# EAGLE design Kopfhörerverstärker DAC Board CP2114 Rev 1.1 (EAGLE 6.4)

## Sheet 1 of 3
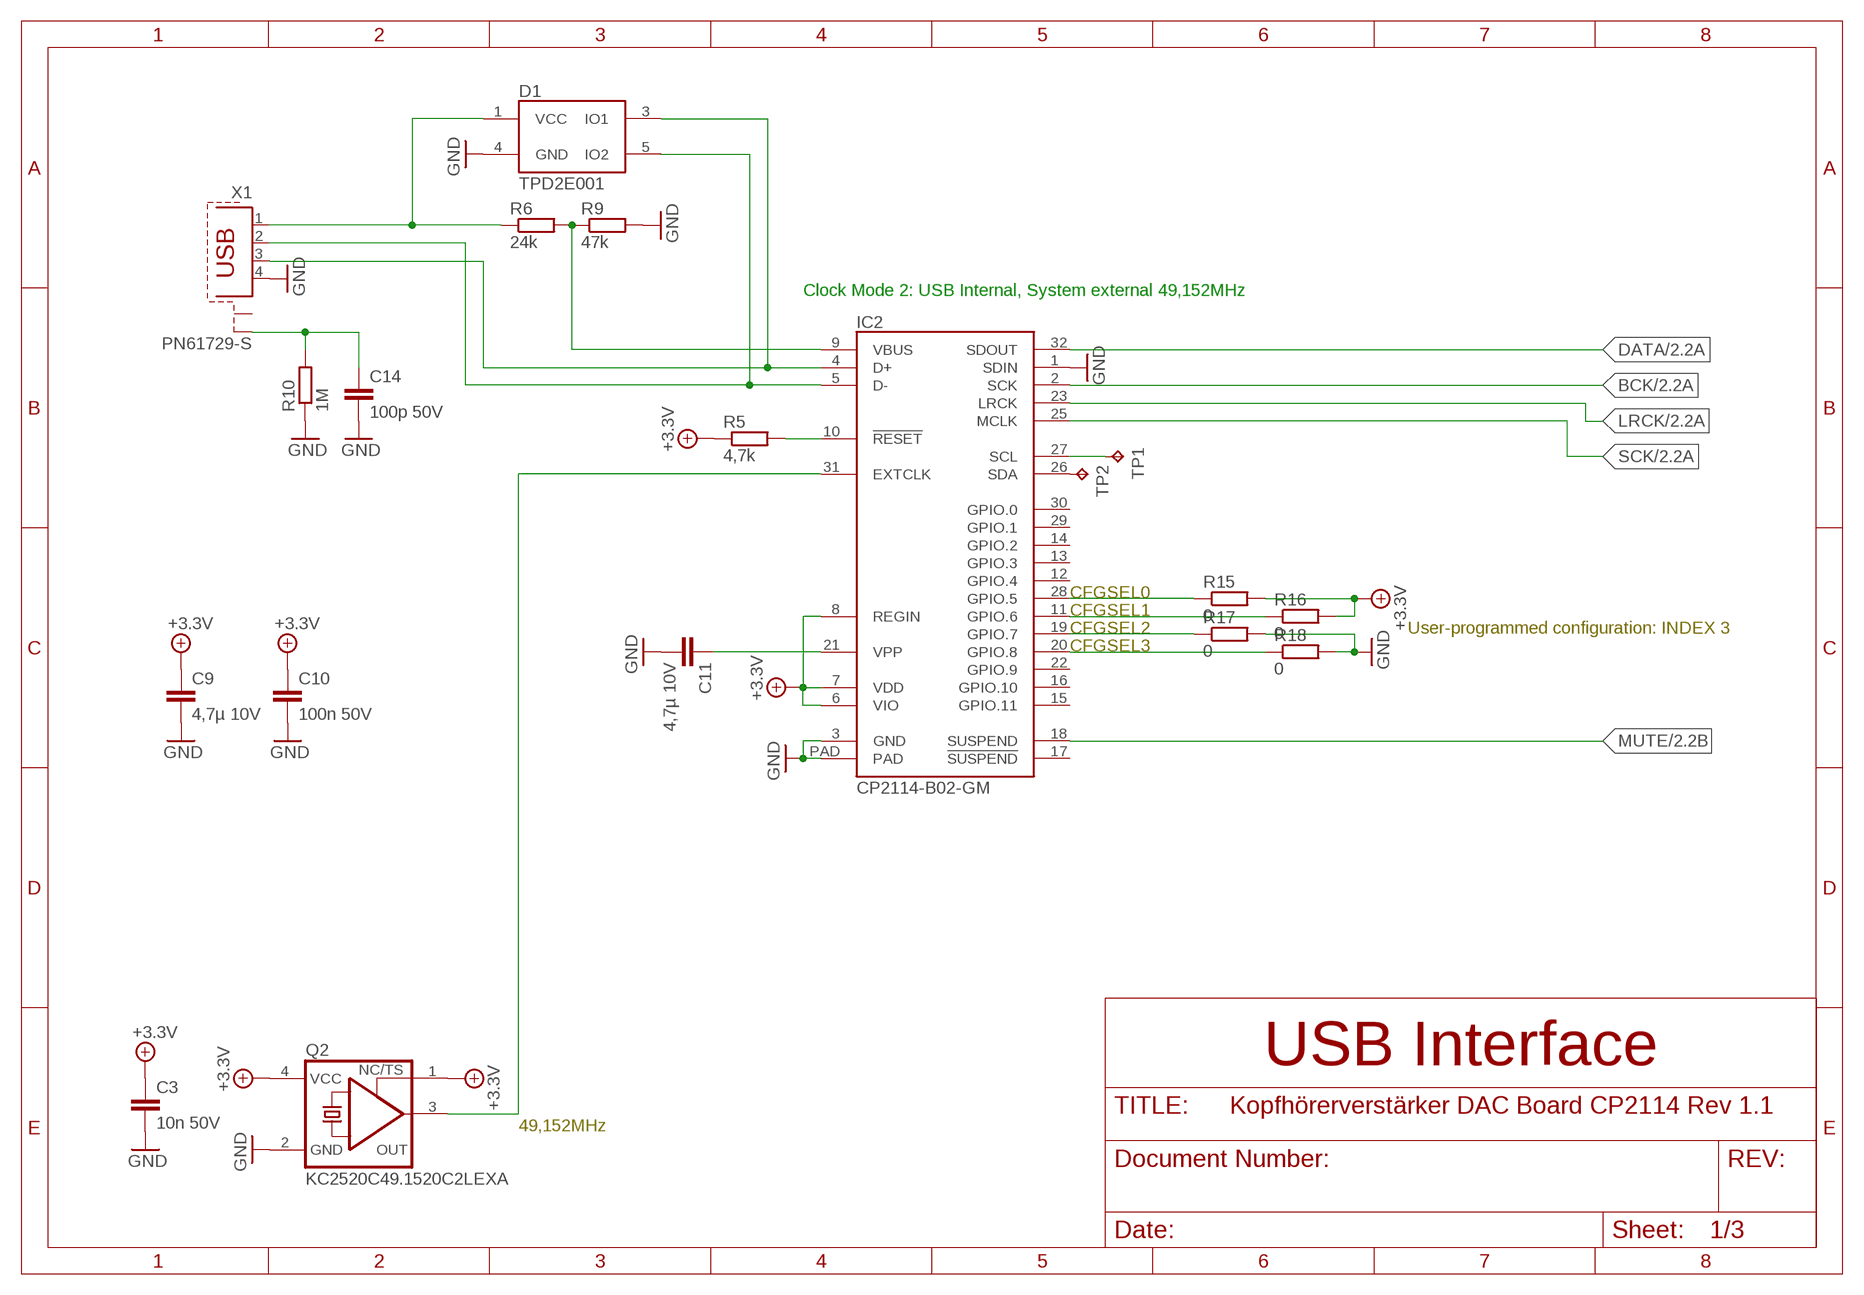
[diagram p0: schematic, sheet 1]

### Parts
C3  10n 50V  C-EUC0805  [C0805]
C9  4,7µ 10V  C-EUC0805  [C0805]
C10  100n 50V  C-EUC0805  [C0805]
C11  4,7µ 10V  C-EUC0805  [C0805]
C14  100p 50V  C-EUC0805  [C0805]
D1  TPD2E001  [SOT-5X3_R-PDSO-N5-DRL]
IC2  CP2114-B02-GM  [QFN32]
Q2  KC2520C49.1520C2LEXA  XO-2,5X2,0  [2.5X2.0]
R5  4,7k  R-EU_R0805  [R0805]
R6  24k  R-EU_R0805  [R0805]
R9  47k  R-EU_R0805  [R0805]
R10  1M  R-EU_R0805  [R0805]
R15  0  R-EU_R0805  [R0805]
R16  0  R-EU_R0805  [R0805]
R17  0  R-EU_R0805  [R0805]
R18  0  R-EU_R0805  [R0805]
TP1  TPTP10R  [TP10R]
TP2  TPTP10R  [TP10R]
X1  PN61729-S  [PN61729-S]

### Nets
+3,3V: C3.1 C9.1 C10.1 IC2.6(VIO) IC2.7(VDD) IC2.8(REGIN) Q2.1(TS) Q2.4(VCC) R5.1 R15.2 R16.2 ; supply symbol labelled +3.3V ; also sheet 3
BCK: IC2.2(SCK) ; also sheet 2
DATA: IC2.32(SDOUT) ; also sheet 2
GND: C3.2 C9.2 C10.2 C11.2 C14.2 D1.4(GND) IC2.1(SDIN) IC2.3(GND) IC2.PAD Q2.2(GND) R9.2 R10.1 R17.2 R18.2 X1.4 ; also sheet 2,3
LRCK: IC2.23(LRCK) ; also sheet 2
MUTE: IC2.18(SUSPEND) ; also sheet 2
N$5: IC2.28(GPIO.5) R15.1
N$10: IC2.31(EXTCLK) Q2.3(OUT)
N$11: IC2.9(VBUS) R6.2 R9.1
N$12: C11.1 IC2.21(VPP)
N$13: IC2.10(!RESET) R5.2
N$17: C14.1 R10.2 X1.S2
N$18: D1.5(IO2) IC2.5(D-) X1.2
N$19: D1.3(IO1) IC2.4(D+) X1.3
N$20: D1.1(VCC) R6.1 X1.1
N$22: IC2.27(SCL) TP1.TP
N$23: IC2.26(SDA) TP2.TP
N$24: IC2.11(GPIO.6) R16.1
N$25: IC2.19(GPIO.7) R17.1
N$26: IC2.20(GPIO.8) R18.1
SCK: IC2.25(MCLK) ; also sheet 2
Unconnected: IC2.12(GPIO.4) IC2.13(GPIO.3) IC2.14(GPIO.2) IC2.15(GPIO.11) IC2.16(GPIO.10) IC2.17(!SUSPEND) IC2.22(GPIO.9) IC2.29(GPIO.1) IC2.30(GPIO.0) X1.S1

### Notes on the sheet
- Clock Mode 2: USB Internal, System external 49,152MHz
- CFGSEL0
- CFGSEL1
- CFGSEL2 | User-programmed configuration: INDEX 3
- CFGSEL3
- USB Interface
- 49,152MHz

## Sheet 2 of 3
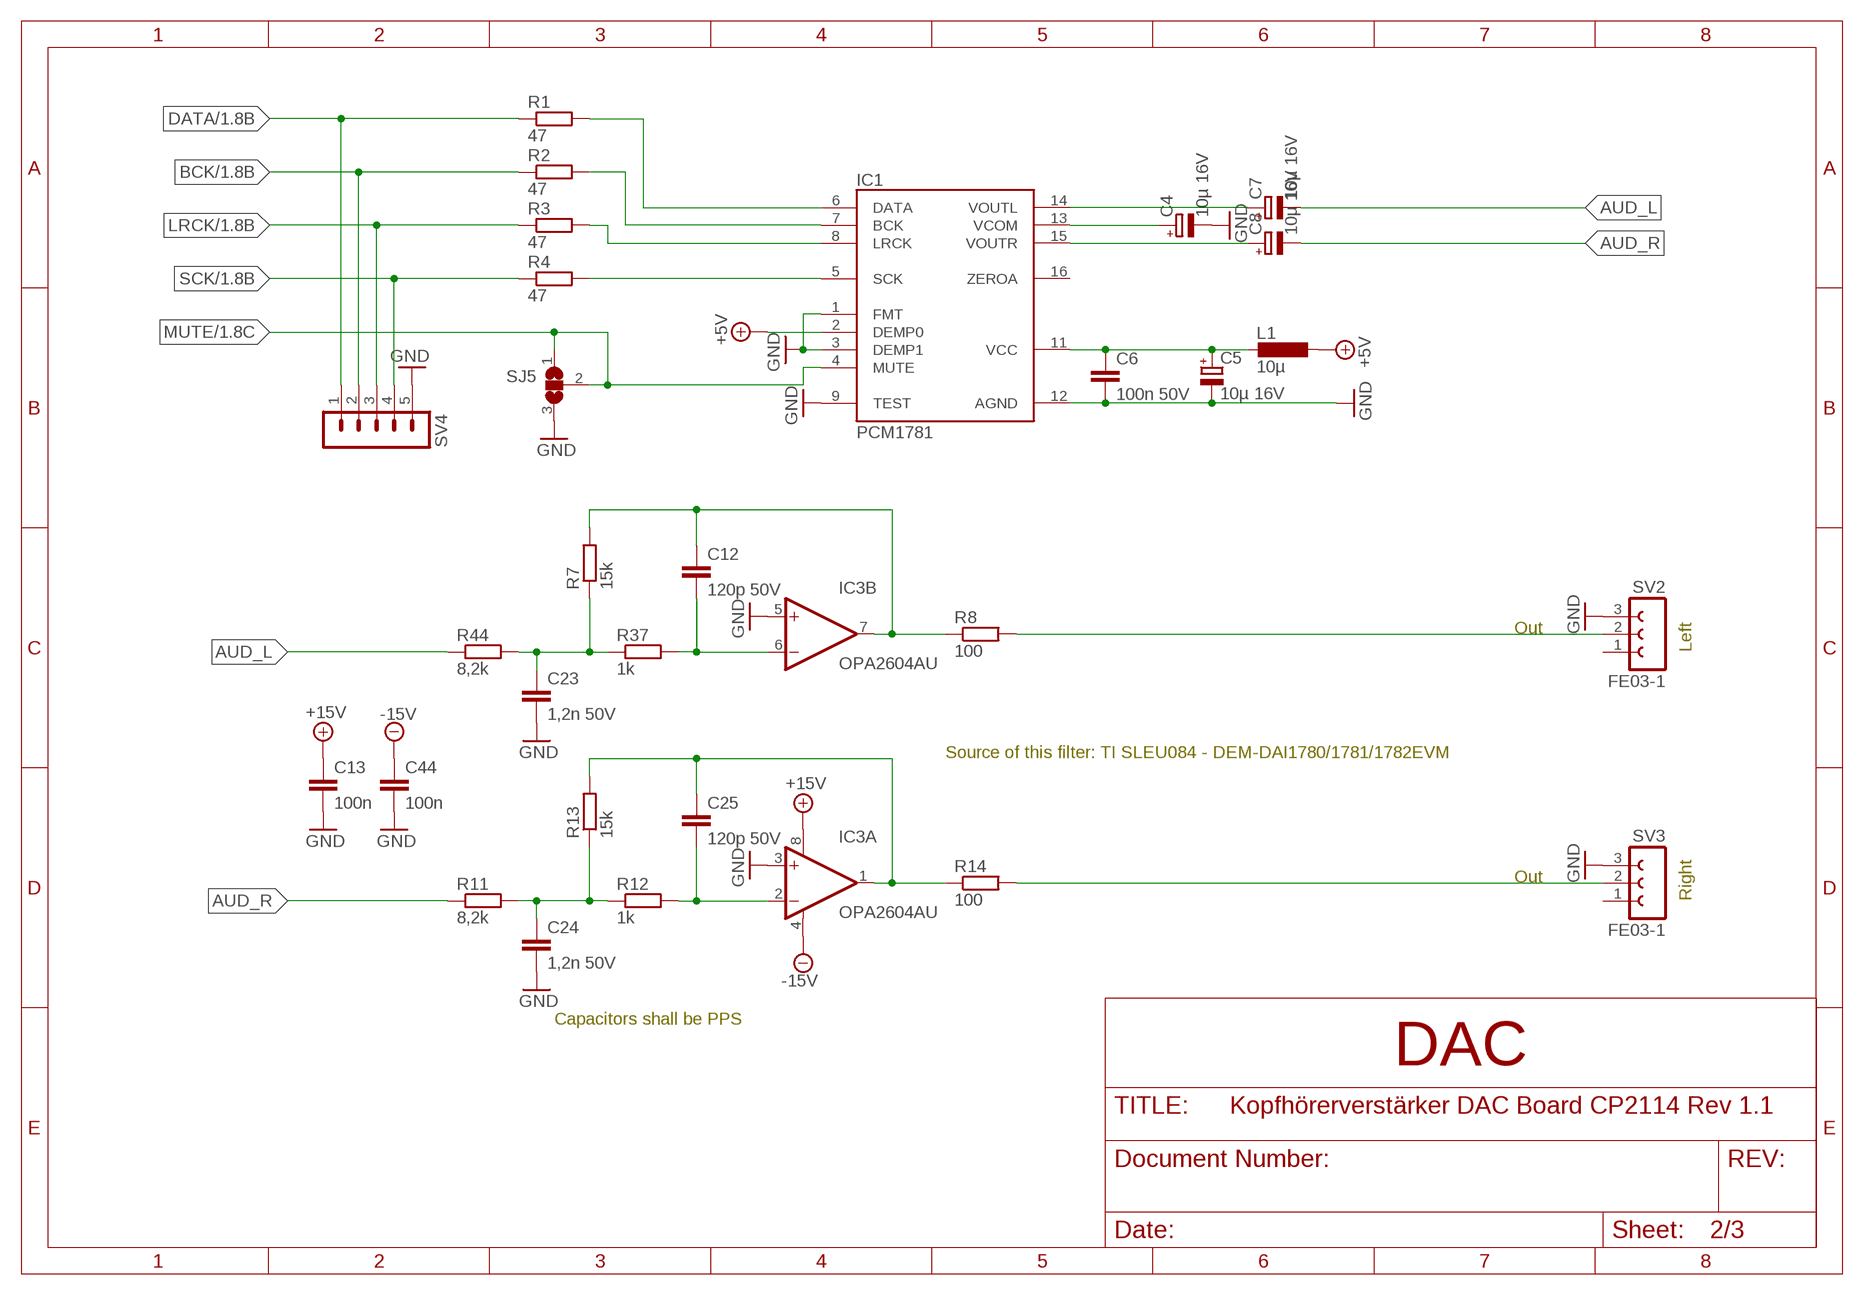
[diagram p1: schematic, sheet 2]

### Parts
C4  10µ 16V  CPOL-EUE2.5-5  [E2,5-5]
C5  10µ 16V  CPOL-EUE2.5-5  [E2,5-5]
C6  100n 50V  C-EUC0805  [C0805]
C7  10µ 16V  CPOL-EUE2.5-5  [E2,5-5]
C8  10µ 16V  CPOL-EUE2.5-5  [E2,5-5]
C12  120p 50V  C-EUC0805  [C0805]
C13  100n  C-EUC0805  [C0805]
C23  1,2n 50V  C-EUC0805  [C0805]
C24  1,2n 50V  C-EUC0805  [C0805]
C25  120p 50V  C-EUC0805  [C0805]
C44  100n  C-EUC0805  [C0805]
IC1  PCM1781  [PW_R-PDSO-G16]
IC3  OPA2604AU  [SO08]
L1  10µ  L-EUL0805  [L0805]
R1  47  R-EU_R0805  [R0805]
R2  47  R-EU_R0805  [R0805]
R3  47  R-EU_R0805  [R0805]
R4  47  R-EU_R0805  [R0805]
R7  15k  R-EU_R0805  [R0805]
R8  100  R-EU_R0805  [R0805]
R11  8,2k  R-EU_R0805  [R0805]
R12  1k  R-EU_R0805  [R0805]
R13  15k  R-EU_R0805  [R0805]
R14  100  R-EU_R0805  [R0805]
R37  1k  R-EU_R0805  [R0805]
R44  8,2k  R-EU_R0805  [R0805]
SJ5  SJ2W  [SJ_2]
SV2  FE03-1  [FE03-1]
SV3  FE03-1  [FE03-1]
SV4  MA05-1  [MA05-1]

### Nets
+5V: IC1.2(DEMP0) L1.1 ; also sheet 3
+15V: C13.1 IC3.8(A:V+) ; also sheet 3
-15V: C44.1 IC3.4(A:V-) ; also sheet 3
AUD_L: C7.- R44.1
AUD_R: C8.- R11.1
BCK: R2.1 SV4.2 ; also sheet 1
DATA: R1.1 SV4.1 ; also sheet 1
GND: C4.- C5.- C6.2 C13.2 C23.2 C24.2 C44.2 IC1.1(FMT) IC1.3(DEMP1) IC1.9(TEST) IC1.12(AGND) IC3.3(A:+IN) IC3.5(B:+IN) SJ5.3 SV2.3 SV3.3 SV4.5 ; also sheet 1,3
LRCK: R3.1 SV4.3 ; also sheet 1
MUTE: IC1.4(MUTE) SJ5.1 SJ5.2 ; also sheet 1
N$1: C23.1 R7.1 R37.1 R44.2
N$2: C8.+ IC1.15(VOUTR)
N$3: C7.+ IC1.14(VOUTL)
N$6: IC1.6(DATA) R1.2
N$7: IC1.7(BCK) R2.2
N$8: IC1.8(LRCK) R3.2
N$9: IC1.5(SCK) R4.2
N$14: C5.+ C6.1 IC1.11(VCC) L1.2
N$15: C4.+ IC1.13(VCOM)
N$16: C25.1 IC3.1(A:OUT) R13.2 R14.1
N$21: R14.2 SV3.2
N$27: C12.2 IC3.6(B:-IN) R37.2
N$28: C12.1 IC3.7(B:OUT) R7.2 R8.1
N$29: R8.2 SV2.2
N$30: C25.2 IC3.2(A:-IN) R12.2
N$31: C24.1 R11.2 R12.1 R13.1
SCK: R4.1 SV4.4 ; also sheet 1
Unconnected: IC1.16(ZEROA) SV2.1 SV3.1

### Notes on the sheet
- Out
- Left
- Source of this filter: TI SLEU084 - DEM-DAI1780/1781/1782EVM
- Out
- Right
- Capacitors shall be PPS
- DAC

## Sheet 3 of 3
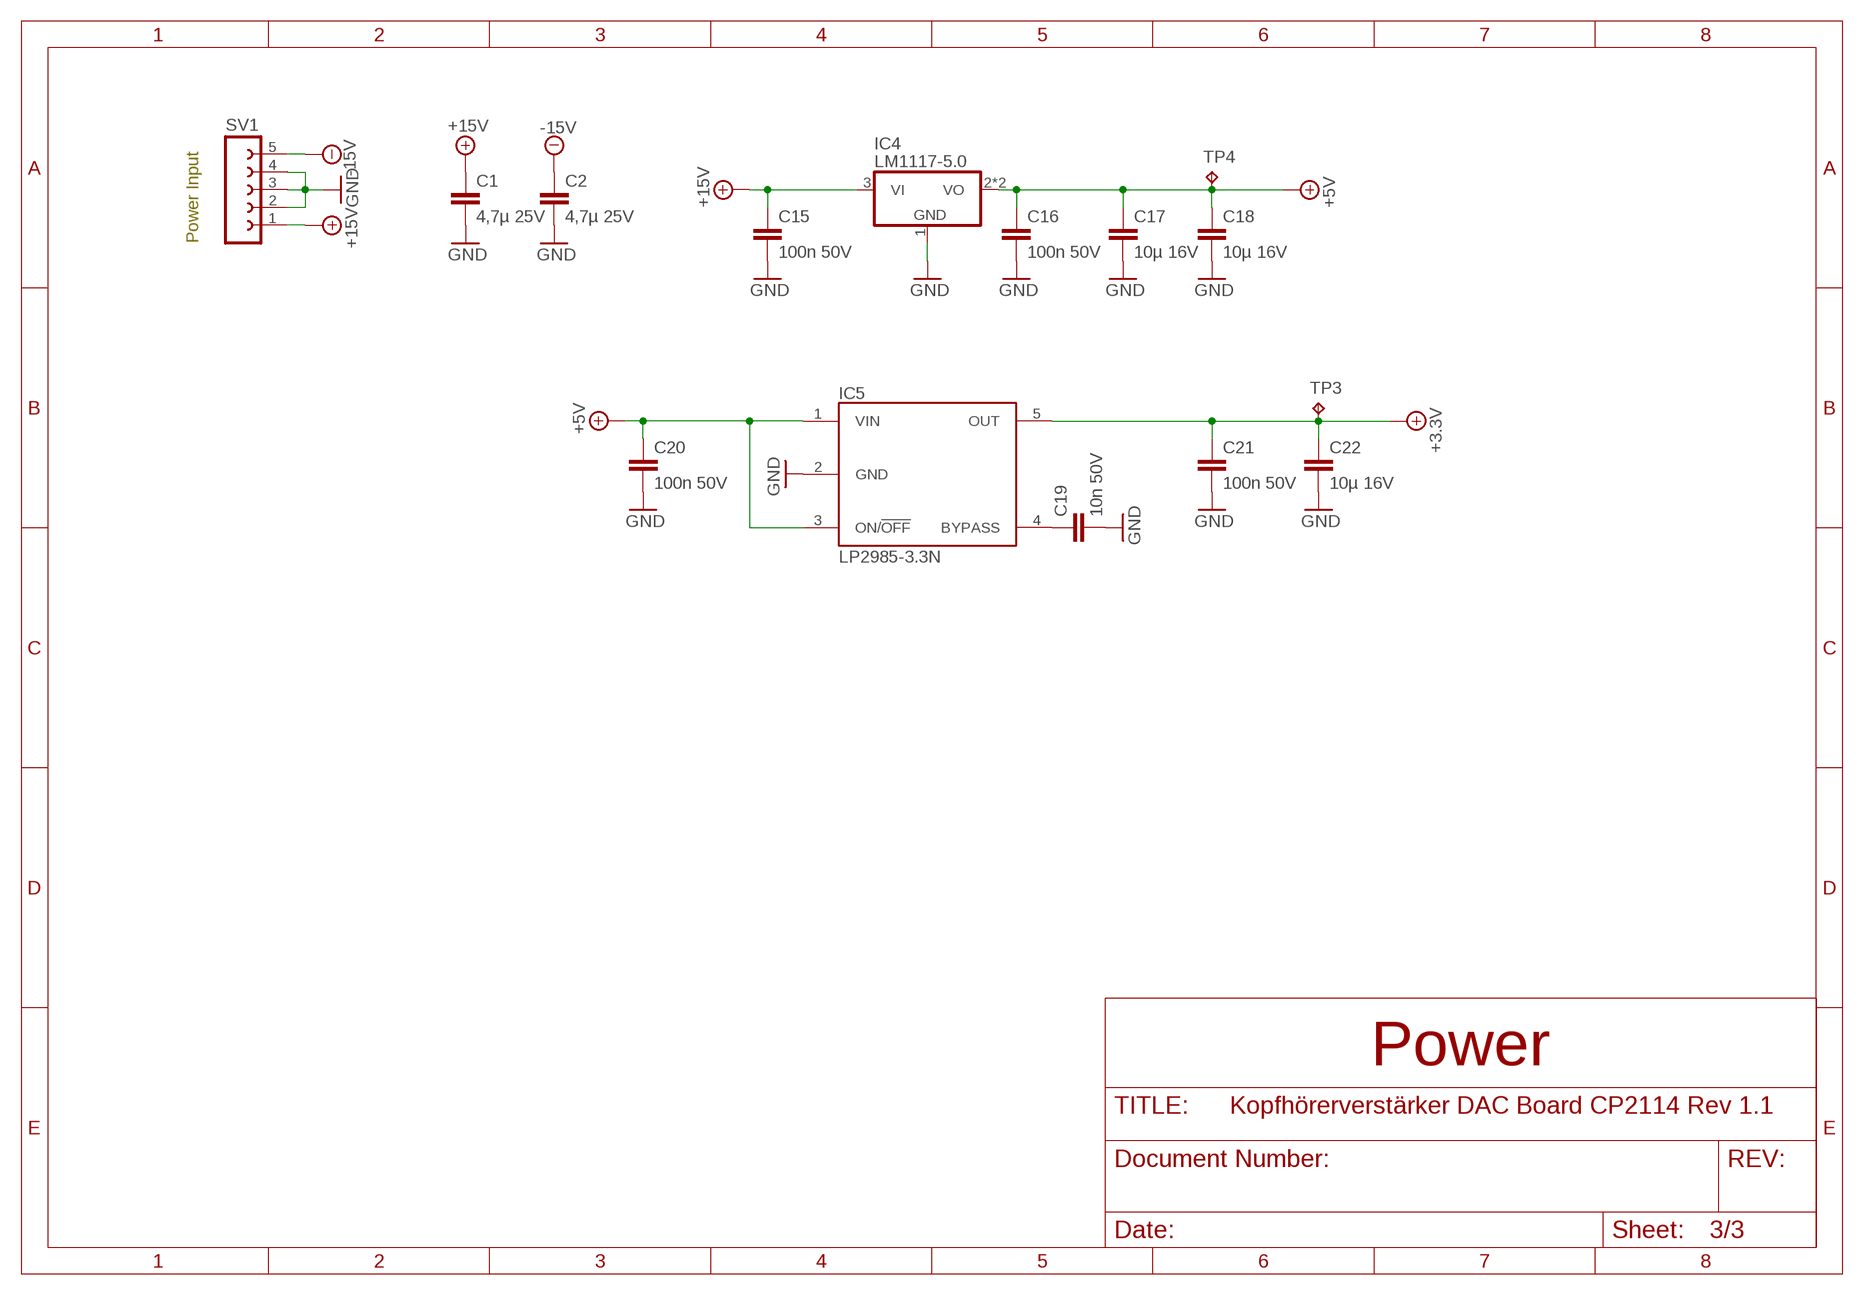
[diagram p2: schematic, sheet 3]

### Parts
C1  4,7µ 25V  C-EUC0805  [C0805]
C2  4,7µ 25V  C-EUC0805  [C0805]
C15  100n 50V  C-EUC0805  [C0805]
C16  100n 50V  C-EUC0805  [C0805]
C17  10µ 16V  C-EUC0805  [C0805]
C18  10µ 16V  C-EUC0805  [C0805]
C19  10n 50V  C-EUC0805  [C0805]
C20  100n 50V  C-EUC0805  [C0805]
C21  100n 50V  C-EUC0805  [C0805]
C22  10µ 16V  C-EUC0805  [C0805]
IC4  LM1117-5.0  [SOT223]
IC5  LP2985-3.3N  [SOT23-DBV]
SV1  FE05-1  [FE05-1]
TP3  TPTP15R  [TP15R]
TP4  TPTP15R  [TP15R]

### Nets
+3,3V: C21.1 C22.1 IC5.5(OUT) TP3.TP ; supply symbol labelled +3.3V ; also sheet 1
+5V: C16.1 C17.1 C18.1 C20.1 IC4.2(VO) IC4.4(VO) IC5.1(VIN) IC5.3(ON/!OFF) TP4.TP ; also sheet 2
+15V: C1.1 C15.1 IC4.3(VI) SV1.1 ; also sheet 2
-15V: C2.1 SV1.5 ; also sheet 2
GND: C1.2 C2.2 C15.2 C16.2 C17.2 C18.2 C19.2 C20.2 C21.2 C22.2 IC4.1(GND) IC5.2(GND) SV1.2 SV1.3 SV1.4 ; also sheet 1,2
N$4: C19.1 IC5.4(BYPASS)

### Notes on the sheet
- Power Input
- Power

## Library data of the parts
C1-C3 C6 C9-C25 C44 = rcl:C-EU: CAPACITOR, European symbol
C4 C5 C7 C8 = rcl:CPOL-EU: POLARIZED CAPACITOR, European symbol
D1 = texas:TPD2E001: TPD2E001 Low-Capacitance 2-Channel ESD-Protection for High-Speed Data Interfaces
IC1 = texas:PCM1781: PCM 1781 - 24-Bit, 192-kHz Sampling, Enhanced Multilevel, Delta-Sigma, Audio Digital-to-Analog Converter
IC2 = silabs:CP2114-B02: CP2114-B02 - USBXpress™ USB Audio to I2S Digital AudioBridge Family
IC3 = burr-brown:OPA2604: Dual FET-Input, Low Distortion LOW DISTORTION: 0.0003% at 1kHz LOW NOISE: 10nV/vHz HIGH SLEW RATE: 25V/µ s WIDE GAIN-BANDWIDTH: 20MHz UNITY-GAIN STABLE WIDE SUPPLY RANGE: VS = ±4.5 to ±24V DRIVES 600? LOADS
IC4 = linear:LM1117: LM1117 800mA Low-Dropout Linear Regulator
IC5 = texas:LP2985: LP2985-N Micropower 150-mA Low-Noise Ultra-Low-Dropout Regulator Features • Input Voltage Range: 2.5 V to 16 V • Ultra Low-Dropout Voltage • Ensured 150 mA Output Current • Requires Minimum External Components • Stable With Low-ESR Output Capacitor • < 1 μA Quiescent Current When Shut Down • Low Ground Pin Current at All Loads • Output Voltage Accuracy 1% (A Grade) • High Peak Current Capability • Low Z OUT : 0.3Ω Typical (10 Hz to 1 MHz) • Overtemperature and Overcurrent Protection • −40°C to 125°C Junction Temperature Range • Custom Voltages Available Applications • Cellular Phones • Palmtop and Laptop Computers • Personal Digital Assistants (PDA) • Camcorders, Personal Stereos, Cameras
L1 = rcl:L-EU: INDUCTOR, European symbol
Q2 = crystal:XO-: CRYSTAL
R1-R18 R37 R44 = rcl:R-EU_: RESISTOR, European symbol
SJ5 = jumper:SJ2W: SMD solder JUMPER
SV1 = con-lsta:FE05-1: FEMALE HEADER; OC_FARNELL: unknown; OC_NEWARK: unknown
SV2 SV3 = con-lsta:FE03-1: FEMALE HEADER
SV4 = con-lstb:MA05-1: PIN HEADER; OC_FARNELL: unknown; OC_NEWARK: unknown
TP1-TP4 = testpad:TP: Test pad
X1 = con-berg:PN61729-S: BERG USB connector; OC_FARNELL: unknown; OC_NEWARK: unknown

## Board
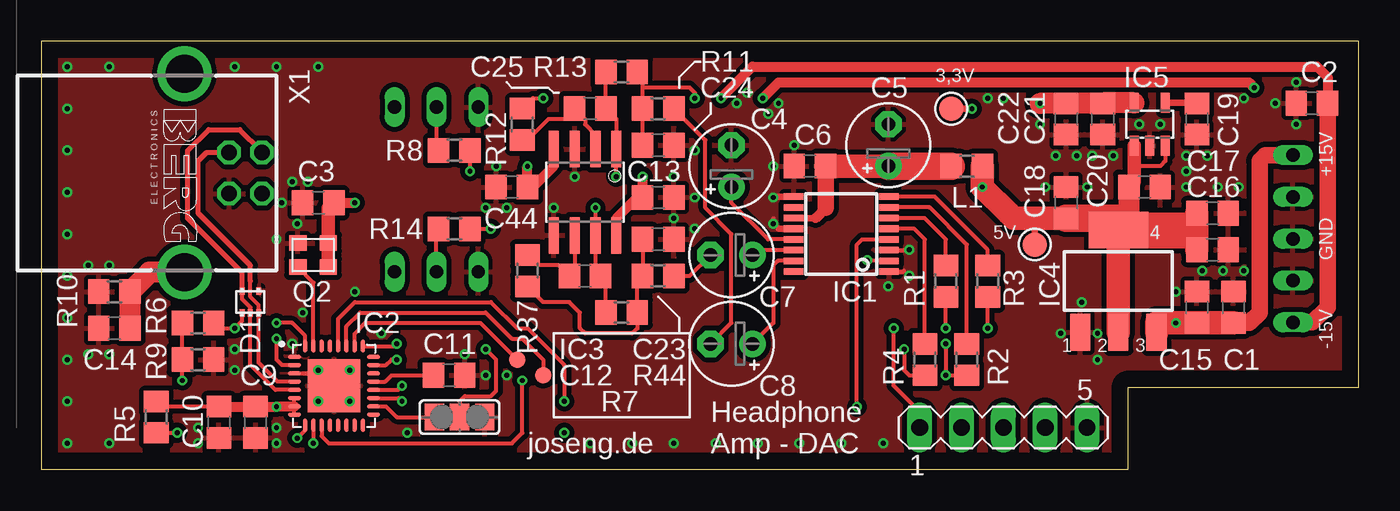
[diagram p3: board, top side]
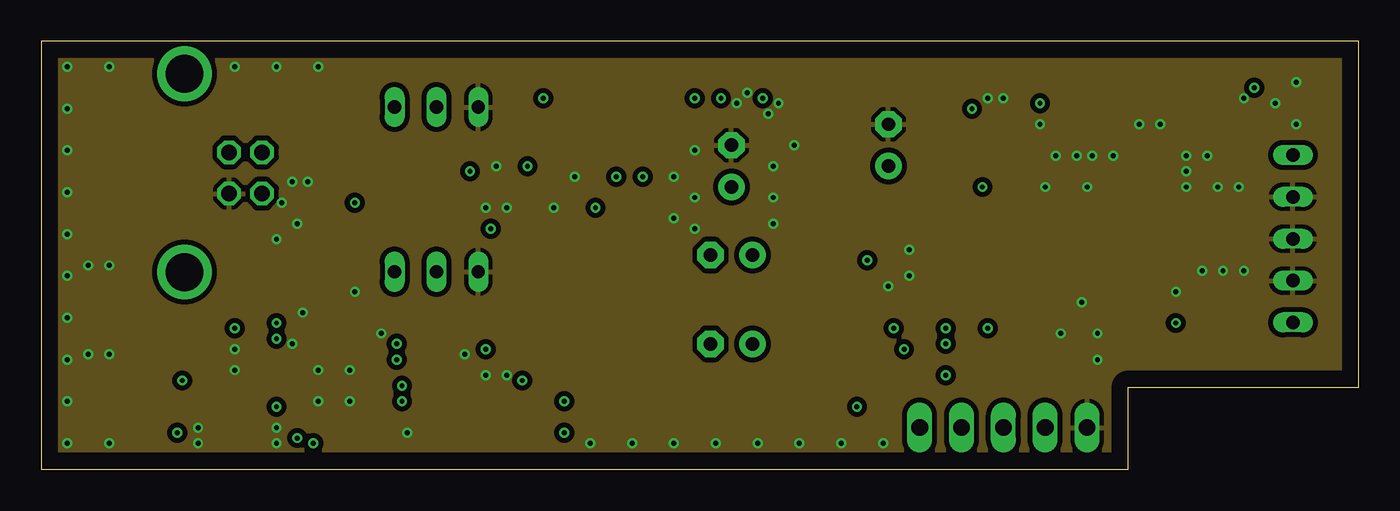
[diagram p4: board, inner layer Route2]
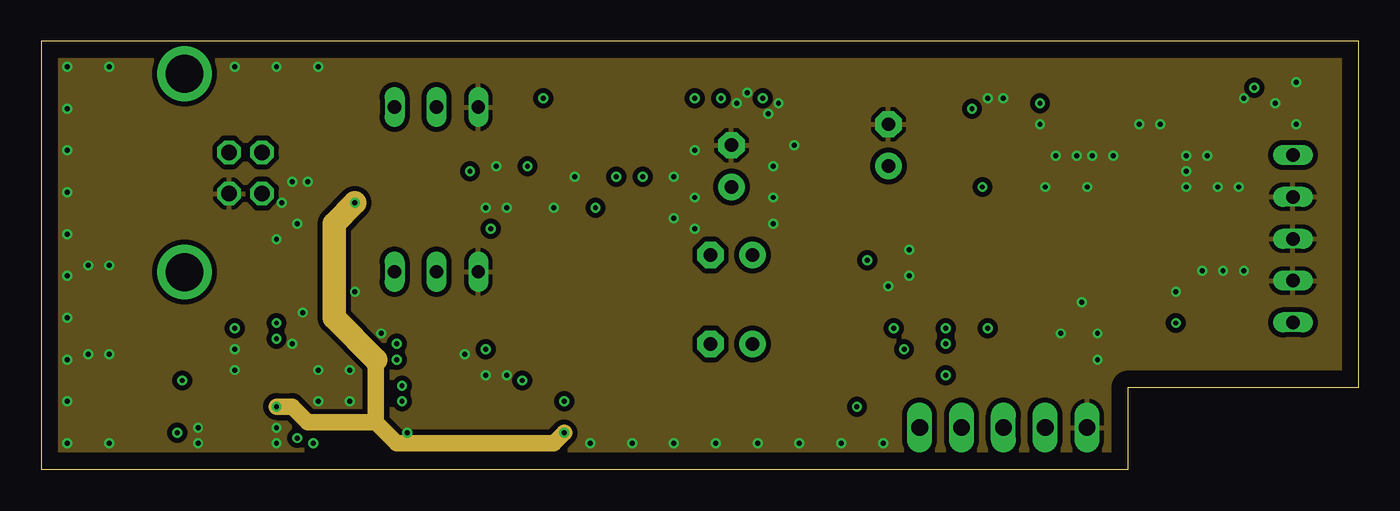
[diagram p5: board, inner layer Route15]
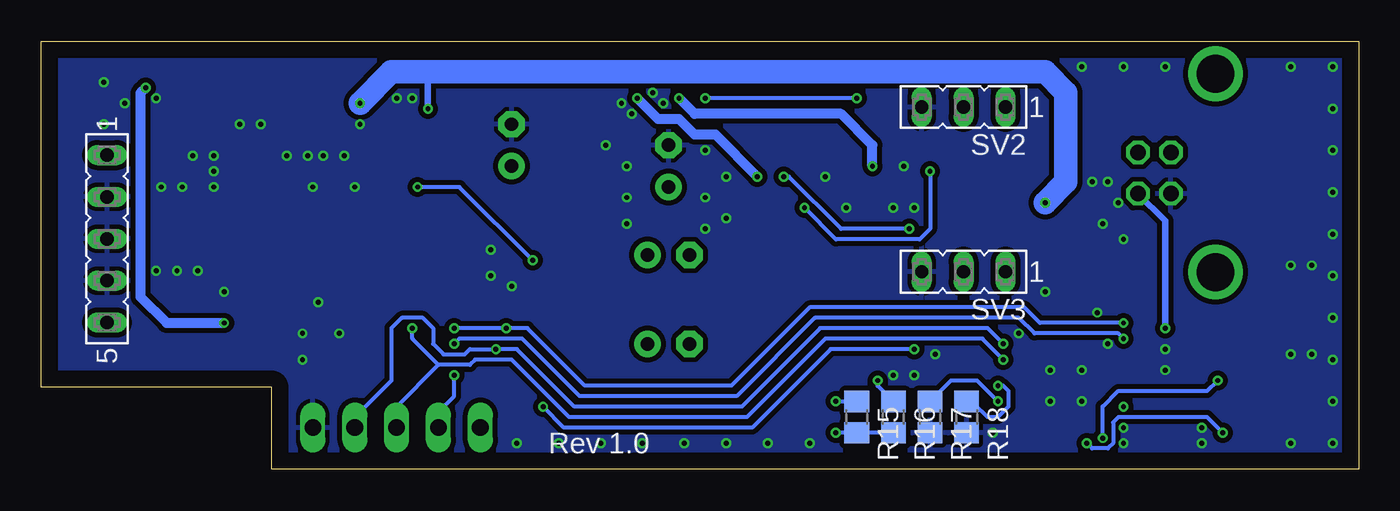
[diagram p6: board, bottom side, seen from below]

Size 80 x 26 mm. Coordinates in mm from the lower left corner, seen from the top.
Outline: 0,0 66,0 66,5 80,5 80,26 0,26 0,0
Copper layers (1+2*15+16): Top 0.035mm / dielectric 0.2mm / Route2 0.0175mm / dielectric 1.065mm / Route15 0.0175mm / dielectric 0.2mm / Bottom 0.035mm
Design rules "JLCPCB 4Layer 1oz JLC7628 *": minimum track width 3.5mil, minimum drill 0.2mm, track to track 3.5mil, track to pad 0.2mm, pad to pad 5mil, via to via 0.2mm, smd to smd 5mil, copper to edge 40mil, drill to drill 0.5mm, minimum pad ring 0.15mm, minimum via ring 0.15mm, stop-mask expansion 2mil, vias tented up to drill 0.3mm, thermal gap 10mil

### Footprints (pad centres in the part's own frame; a part is rotated, then mirrored left to right if it is on the bottom)
C0805 = smd 1.3 x 1.5: 1 -0.95,0; 2 0.95,0
E2,5-5 = drill 0.813 pad 1.6: + -1.27,0 | drill 0.813 pad 1.6 octagon: - 1.27,0
SOT-5X3_R-PDSO-N5-DRL = smd 0.3 x 0.45: 1 -0.5,-0.675; 2 0,-0.675; 3 0.5,-0.675; 4 0.5,0.675; 5 -0.5,0.675
PW_R-PDSO-G16 = smd 0.4 x 1.2: 1 -2.275,-2.9; 2 -1.625,-2.9; 3 -0.975,-2.9; 4 -0.325,-2.9; 5 0.325,-2.9; 6 0.975,-2.9; 7 1.625,-2.9; 8 2.275,-2.9; 9 2.275,2.9; 10 1.625,2.9; 11 0.975,2.9; 12 0.325,2.9; 13 -0.325,2.9; 14 -0.975,2.9; 15 -1.625,2.9; 16 -2.275,2.9
QFN32 = smd 0.8 x 0.25: 1 -2.4,1.75; 2 -2.4,1.25; 3 -2.4,0.75; 4 -2.4,0.25; 5 -2.4,-0.25; 6 -2.4,-0.75; 7 -2.4,-1.25; 8 -2.4,-1.75; 17 2.4,-1.75; 18 2.4,-1.25; 19 2.4,-0.75; 20 2.4,-0.25; 21 2.4,0.25; 22 2.4,0.75; 23 2.4,1.25; 24 2.4,1.75 | smd 0.25 x 0.8: 9 -1.75,-2.4; 10 -1.25,-2.4; 11 -0.75,-2.4; 12 -0.25,-2.4; 13 0.25,-2.4; 14 0.75,-2.4; 15 1.25,-2.4; 16 1.75,-2.4; 25 1.75,2.4; 26 1.25,2.4; 27 0.75,2.4; 28 0.25,2.4; 29 -0.25,2.4; 30 -0.75,2.4; 31 -1.25,2.4; 32 -1.75,2.4 | smd 3.2 x 3.2: PAD 0,0
SO08 = smd 0.61 x 2.21: 1 -1.905,-2.616; 2 -0.635,-2.616; 3 0.635,-2.616; 4 1.905,-2.616; 5 1.905,2.616; 6 0.635,2.616; 7 -0.635,2.616; 8 -1.905,2.616
SOT223 = smd 1.219 x 2.235: 1 -2.311,-3.099; 2 0,-3.099; 3 2.311,-3.099 | smd 3.6 x 2.2: 4 0,3.099
SOT23-DBV = smd 0.55 x 1.2: 1 -0.95,-1.3; 2 0,-1.3; 3 0.95,-1.3; 4 0.95,1.3; 5 -0.95,1.3
L0805 = smd 1.3 x 1.5: 1 -0.95,0; 2 0.95,0
2.5X2.0 = smd 1.05 x 0.95: 1 -0.925,-0.725; 2 0.925,-0.725; 3 0.925,0.725; 4 -0.925,0.725
R0805 = smd 1.3 x 1.5: 1 -0.95,0; 2 0.95,0
SJ_2 = smd 1.168 x 1.6: 1 -1.524,0; 2 0,0; 3 1.524,0
FE05-1 = drill 0.813 long: 1 -5.08,0; 2 -2.54,0; 3 0,0; 4 2.54,0; 5 5.08,0
FE03-1 = drill 0.813 long: 1 0,0; 2 2.54,0; 3 5.08,0
MA05-1 = drill 1.016 long: 1 -5.08,0; 2 -2.54,0; 3 0,0; 4 2.54,0; 5 5.08,0
TP10R = smd 1 x 1: TP 0,0
TP15R = smd 1.5 x 1.5: TP 0,0
PN61729-S = drill 0.95 octagon: 1 1.25,4.71; 2 -1.25,4.71; 3 -1.25,2.71; 4 1.25,2.71 | drill 2.3 pad 2.9: S1 -6.02,0; S2 6.02,0

### Placement (x,y rotation side)
C1  72.39,9.84 90 top
C2  77.15,22.23 180 top
C3  16.83,16.19 180 top
C4  41.91,18.41 90 top
C5  51.44,19.68 90 top
C6  46.67,18.41 180 top
C7  41.91,13.02 180 top
C8  41.91,7.62 180 top
C9  13.02,2.86 270 top
C10  10.79,2.86 270 top
C11  24.77,5.71 0 top
C12  33.02,11.75 180 top
C13  37.47,16.51 0 top
C14  4.45,8.57 180 top
C15  70.17,9.84 90 top
C16  71.12,13.34 0 top
C17  71.12,15.56 0 top
C18  62.23,16.19 90 top
C19  70.17,21.27 270 top
C20  66.99,17.14 0 top
C21  64.45,21.27 270 top
C22  62.23,21.27 270 top
C23  37.47,13.97 0 top
C24  37.47,19.68 0 top
C25  33.34,21.91 180 top
C44  28.57,17.14 180 top
D1  12.7,10.16 0 top
IC1  48.58,14.29 90 top
IC2  17.78,5.08 0 top
IC3  33.02,16.83 180 top
IC4  65.41,11.43 0 top
IC5  67.31,20.95 0 top
L1  56.2,18.41 180 top
Q2  16.51,13.02 180 top
R1  54.93,11.43 90 top
R2  56.2,6.67 90 top
R3  57.47,11.43 90 top
R4  53.66,6.67 90 top
R5  6.99,3.17 270 top
R6  9.53,8.89 180 top
R7  35.24,9.53 180 top
R8  25.08,19.37 180 top
R9  9.53,6.67 0 top
R10  4.45,10.79 0 top
R11  37.47,21.91 180 top
R12  29.21,20.95 270 top
R13  35.24,24.13 180 top
R14  25.08,14.61 180 top
R15  30.48,3.17 270 bottom
R16  28.26,3.17 270 bottom
R17  26.04,3.17 270 bottom
R18  23.81,3.17 270 bottom
R37  29.53,12.06 90 top
R44  37.47,11.75 180 top
SJ5  25.4,3.17 0 top
SV1  76,14 270 bottom
SV2  21.46,22 180 bottom
SV3  21.46,12 180 bottom
SV4  58.42,2.54 0 top
TP1  30.48,5.71 0 top
TP2  28.89,6.67 0 top
TP3  55.24,21.91 0 top
TP4  60.33,13.65 0 top
X1  8.7,18 270 top

### Tracks (layer width: path | path; a pad name or v marks a point on that pad's centre or on a via)
+3,3V  (via drill 0.3)
  Top 0.254: IC2.8 IC2.7 IC2.6 | C10.1 7.3,3.81 R5.1
  Top 0.305: 13.34,3.81 C9.1
  Top 0.406: TP3.TP v56.52,21.91
  Top 0.61: 17.43,15.85 C3.1 v19.05,16.19 | C10.1 C9.1 | 13.34,3.81 v14.29,3.81 15.36,3.81 IC2.7
  Top 0.813: Q2.4 Q2.1 17.43,15.85
  Top 1.27: IC5.5 64.48,22.25 C21.1 C22.1 v60.64,22.23
  Route15 1.016: v31.75,2.22 31.11,1.59 21.59,1.59 20.32,2.86 | v14.29,3.81 15.24,3.81 16.19,2.86 20.32,2.86 | 20.32,6.67 20.32,2.86
  Route15 1.422: v19.05,16.19 17.78,14.92 17.78,9.21 20.32,6.67
  Bottom 0.254: R16.2 R15.2 v31.75,2.22
  Bottom 0.406: 56.52,24.13 v56.52,21.91
  Bottom 1.422: v19.05,16.19 17.78,17.46 17.78,22.86 19.05,24.13 56.52,24.13 58.74,24.13 v60.64,22.23
+5V  (via drill 0.3)
  Top 0.254: 68.26,19.05 IC5.3 68.26,18.73 67.94,18.41 66.36,18.41 | 66.36,19.05 IC5.1 | IC1.2 50.2,12.66 v50.16,12.7
  Top 0.406: TP4.TP 60.33,15.24 59.05,15.24 58.74,15.56
  Top 0.813: IC5.1 66.36,18.41 66.36,17.46 C20.1
  Top 1.016: L1.1
  Top 1.27: C20.1 66.04,14.53 IC4.4 65.64,15.24
  Top 1.422: L1.1 v57.15,17.14 58.74,15.56 59.05,15.24 C18.1 | C17.1 70.17,13.97 | 70.17,13.97 C16.1 | 69.77,14.53 70.09,14.37 70.17,13.97 | IC4.2 IC4.4
  Top 1.676: C18.1 65.64,15.24
  Top 2.184: IC4.4 69.77,14.53
  Bottom 0.254: v50.16,12.7 54.61,17.14 v57.15,17.14
+15V  (via drill 0.3)
  Top 0.61: IC3.8 34.92,15.24 36.2,16.51 C13.1 v36.52,17.78 v36.51,17.78 | v73.66,23.18 73.34,23.5 44.77,23.5 v43.81,22.54
  Top 1.016: SV1.1 74.33,19.08 73.98,18.73 73.98,9.53 73.34,8.89 C1.1
  Top 1.422: IC4.3 67.72,8.89 | 67.72,8.89 | 67.72,8.89 v68.9,8.89 C15.1 C1.1
  Bottom 0.61: v36.51,17.78 39.05,20.32 40.32,20.32 41.27,21.27 42.55,21.27 v43.81,22.54 | v73.66,23.18 73.98,22.86 73.98,10.48 C1.1 v68.9,8.89
-15V  (via drill 0.3)
  Top 0.61: IC3.4 31.11,18.41 29.84,17.14 C44.1 v29.52,18.41 v29.53,18.41 | v41.27,22.54 43.18,24.45 77.47,24.45 78.11,23.81 C2.1
  Top 1.016: SV1.5 77.18,8.92 78.11,9.84 C2.1
  Bottom 0.61: v29.53,18.41 29.53,19.68 31.43,21.59 40.32,21.59 v41.27,22.54
AUD_L
  Top 0.254: R44.1 39.37,11.75 C7.-
AUD_R
  Top 0.254: C8.- 41.91,8.89 41.91,14.29 40.32,15.88 40.32,20 R11.1
BCK  (via drill 0.3)
  Top 0.254: IC2.2 14.62,6.33 14.29,6.67 v14.29,7.94 | v54.93,7.62 v54.93,5.71 R2.1
  Bottom 0.254: v14.29,7.94 14.61,8.26 19.68,8.26 20.64,9.21 33.02,9.21 37.78,4.45 47.31,4.45 50.8,7.94 54.61,7.94 v54.93,7.62 | SV4.2 55.88,3.49 54.93,4.45 v54.93,5.71
DATA  (via drill 0.3)
  Top 0.254: IC2.32 16.03,8.1 15.24,8.89 v14.29,8.89 | v54.93,8.57 R1.1 | SV4.1 53.34,3.49 51.75,5.08 v51.75,8.57
  Bottom 0.254: v14.29,8.89 19.37,8.89 20.32,9.84 33.34,9.84 38.1,5.08 46.99,5.08 50.48,8.57 v51.75,8.57 v54.93,8.57
GND  (via drill 0.3)
  Top 0.254: IC2.3 16.62,5.83 v16.83,6.03 | IC1.1 52.34,12.01 52.39,12.06 | IC1.3 52.37,13.31 52.39,13.34 | 44.77,14.61 44.45,14.94 44.45,15.24
  Top 0.305: v16.83,4.13 IC2.PAD
  Top 0.406: IC1.12 44.77,14.61 | IC1.9 44.5,16.56 v44.45,16.51
  other vias: 9.53,1.59 9.53,2.54 14.29,2.54 14.29,1.59 18.73,6.03 18.73,4.13 26.99,5.71 25.72,6.99 2.86,12.38 2.86,6.99 4.13,12.38 4.13,6.99 11.75,7.3 11.75,6.03 15.24,7.62 52.7,13.34 52.7,11.75 51.44,11.11 66.67,20.95 69.53,18.1 69.53,17.14 69.53,19.05 71.44,17.14 72.71,17.14 71.75,12.06 73.03,12.06 67.94,20.95 70.48,12.06 68.9,10.79 61.91,8.26 63.18,10.16 64.14,8.26 64.14,6.67 60.96,17.14 61.59,19.05 62.87,19.05 63.5,17.14 63.82,19.05 65.09,19.05 70.8,19.05 44.45,18.41 44.13,21.59 45.72,19.68 44.45,14.92 14.61,16.19 15.24,17.46 16.19,17.46 14.29,13.97 15.56,14.92 28.26,5.71 28.26,15.88 27.62,18.41 26.99,15.88 38.42,15.24 39.69,14.61 39.69,16.51 38.42,17.78 39.69,19.37 32.38,17.78 31.11,15.88 44.77,22.23 42.86,22.86 42.23,22.23 73.03,22.54 74.93,22.23 76.2,23.5 76.2,20.95 51.12,1.59 48.58,1.59 46.04,1.59 43.5,1.59 40.96,1.59 38.42,1.59 35.88,1.59 33.34,1.59 1.59,1.59 4.13,1.59 1.59,4.13 1.59,14.29 1.59,16.83 1.59,19.37 1.59,21.91 1.59,24.45 4.13,24.45 11.75,24.45 14.29,24.45 16.83,24.45 19.05,10.79 15.88,9.53 20.64,8.26 1.59,11.75 1.59,9.21 1.59,6.67 60.64,20.95 58.42,22.54 57.47,22.54 22.23,2.22
  pour Bottom (isolate 0.305): 0,0 80.01,0 80.01,27.94 0,27.94
  pour Top (isolate 0.305): 0,0 80.01,0 80.01,31.75 0,31.75
  pour Route15 (isolate 0.305, rank 6): 0,0 80.01,0 80.01,29.21 0,29.21
  pour Route2 (isolate 0.305): 0,0 80.01,0 80.01,30.48 0,30.48
LRCK  (via drill 0.3)
  Top 0.254: IC2.23 20.93,6.33 21.27,6.67 v21.59,6.67 | v57.47,8.57 R3.1
  Bottom 0.254: v21.59,6.67 22.86,7.94 32.38,7.94 37.15,3.17 47.94,3.17 51.44,6.67 53.66,6.67 53.98,6.35 55.88,6.35 | 55.88,6.35 57.47,7.94 v57.47,8.57 | SV4.3 58.42,3.81 55.88,6.35
MUTE  (via drill 0.3)
  Top 0.254: IC2.18 20.93,3.83 21.59,3.17 SJ5.1 SJ5.2 | SJ5.2 25.4,3.49 | v26.99,7.3 27.62,6.67 27.62,4.76 27.3,4.45 25.72,4.45 25.4,4.13 SJ5.2 | v49.53,3.81 49.53,13.65 49.85,13.97 IC1.4
  Bottom 0.254: v26.99,7.3 32.07,7.3 36.83,2.54 48.26,2.54 v49.53,3.81
N$1
  Top 0.254: R37.1 30.48,10.16 32.07,10.16 32.7,9.53 32.7,8.57 33.02,8.26 35.88,8.26 36.19,8.57 R7.1 36.19,11.43 R44.2 C23.1
N$2
  Top 0.254: IC1.15 44.73,12.66 44.45,12.38 44.45,8.89 C8.+
N$3
  Top 0.254: IC1.14 43.48,13.31 C7.+
N$4
  Top 0.406: IC5.4 70.14,22.25 C19.1
N$5  (via drill 0.3)
  Top 0.254: IC2.28 18.03,9.14 19.05,10.16 27.3,10.16 28.89,8.57 29.53,8.57 31.75,6.35 v31.75,4.13
  Bottom 0.254: v31.75,4.13 v31.75,4.12 R15.1
N$6
  Top 0.254: R1.2 54.93,13.97 53.63,15.26 IC1.6
N$7
  Top 0.254: R2.2 56.2,13.65 53.94,15.91 IC1.7
N$8
  Top 0.254: R3.2 57.47,13.34 54.24,16.56 IC1.8
N$9
  Top 0.254: R4.2 53.66,13.97 53.02,14.61 IC1.5
N$10
  Top 0.254: IC2.31 16.53,11.35 Q2.3
N$11  (via drill 0.3)
  Top 0.254: R6.2 R9.1 v8.57,5.4 | IC2.9 16.03,2.38 v15.56,1.91
  Bottom 0.254: v15.56,1.91 15.56,3.81 14.61,4.76 9.21,4.76 v8.57,5.4
N$12
  Top 0.254: IC2.21 20.89,5.33 21.27,5.71 C11.1
N$13  (via drill 0.3)
  Top 0.254: IC2.10 16.53,1.61 v16.51,1.59 | R5.2 v8.26,2.22
  Bottom 0.254: v8.26,2.22 9.21,3.17 14.61,3.17 14.92,2.86 14.92,1.59 15.24,1.27 16.19,1.27 v16.51,1.59
N$14
  Top 0.406: IC1.11 47.01,15.26 | C6.1
  Top 0.61: 47.01,15.26 47.62,15.88
  Top 1.016: 47.62,15.88 C6.1
  Top 1.422: C5.+ C6.1
  Top 1.676: L1.2 C5.+
N$15
  Top 0.254: IC1.13 44.14,13.96 41.91,16.19 C4.+
N$16  (via drill 0.3)
  Top 0.254: R13.2 C25.1 34.92,21.27 IC3.1 v34.92,17.78 | R14.1 v27.3,14.61
  Bottom 0.254: v27.3,14.61 31.43,14.61 34.61,17.78 v34.92,17.78
N$17
  Top 1.27: X1.S2 6.58,11.98 R10.2 C14.1
N$18
  Top 0.254: IC2.5 14.22,4.83 12.7,6.35 12.7,9.84 12.2,10.34 D1.5
  Top 0.305: D1.5 12.2,11.93 8.89,15.24 8.89,19.37 10.16,20.64 12.06,20.64 13.34,19.37 13.34,19.32 X1.2
N$19
  Top 0.254: IC2.4 14.36,5.33 13.2,6.49 D1.3 13.2,9.98 12.7,10.48 12.7,11.43
  Top 0.305: 12.7,11.43 12.7,12.38 9.53,15.56 9.53,18.73 10.04,19.25 X1.3
N$20  (via drill 0.3)
  Top 0.254: D1.1 12.2,9.03 v11.75,8.57 10.79,8.57 R6.1
  Bottom 0.406: X1.1 11.75,15.09 v11.75,8.57
N$21
  Top 0.254: SV3.2 24,14.47 R14.2
N$22
  Top 0.254: IC2.27 18.53,8.69 19.37,9.53 26.99,9.53 28.57,7.94 29.21,7.94 30.48,6.67 TP1.TP
N$23
  Top 0.254: IC2.26 19.03,8.23 19.68,8.89 26.67,8.89 TP2.TP
N$24  (via drill 0.3)
  Top 0.254: IC2.11 17.03,2.02 17.46,1.59 28.57,1.59 29.21,2.22 v29.21,5.4
  Bottom 0.254: R16.1 29.21,5.08 v29.21,5.4
N$25  (via drill 0.3)
  Top 0.254: IC2.19 21.7,4.33 v21.91,4.13
  Bottom 0.254: v21.91,4.13 23.18,5.4 24.77,5.4 25.72,4.45 25.72,4.44 R17.1
N$26  (via drill 0.3)
  Top 0.254: IC2.20 21.66,4.83 v21.91,5.08
  Bottom 0.254: v21.91,5.08 21.59,5.08 21.27,4.76 21.27,3.81 21.91,3.17 22.54,3.17 23.3,3.94 23.62,3.94 R18.1
N$27
  Top 0.254: R37.2 30.16,12.38 31.43,12.38 C12.2 32.38,12.06 IC3.6
N$28  (via drill 0.3)
  Top 0.254: R7.2 34.29,11.43 C12.1 33.66,12.06 IC3.7 v33.66,15.88 | R8.1 v26.03,18.1 v26.04,18.1
  Bottom 0.254: v26.04,18.1 26.04,14.61 26.67,13.97 31.75,13.97 v33.66,15.88
N$29
  Top 0.254: SV2.2 24,19.5 R8.2
N$30
  Top 0.254: IC3.2 33.66,20.32 33.02,20.95 33.02,21.27 C25.2 31.75,21.27 30.8,21.27 29.53,20 R12.2
N$31  (via drill 0.3)
  Top 0.254: C24.1 R11.2 36.52,23.18 | 36.52,23.18 36.52,23.81 R13.1 | R12.1 29.85,22.54 v30.48,22.54 | v39.69,22.54 39.69,22.86 39.37,23.18 36.52,23.18
  Bottom 0.254: v30.48,22.54 v39.69,22.54
SCK  (via drill 0.3)
  Top 0.254: IC2.25 21.45,7.48 v21.59,7.62 | v52.39,7.3 52.39,6.03 52.7,5.71 R4.1
  Bottom 0.254: v21.59,7.62 22.54,8.57 32.7,8.57 37.47,3.81 47.62,3.81 51.12,7.3 v52.39,7.3 53.98,7.3 54.29,6.99 55.56,6.99 56.2,7.62 56.2,8.57 56.83,9.21 58.1,9.21 58.74,8.57 58.74,5.4 60.96,3.17 SV4.4

### Text on the board
tPlace: 3,3V | +15V | 5V | GND | -15V | joseng.de | Headphone / Amp - DAC
bPlace: Rev 1.0